# Altium schematic sheet [1]block_diagram.SchDoc
size A0; DocumentNumber: 1; SheetNumber: 1; SheetTotal: 11
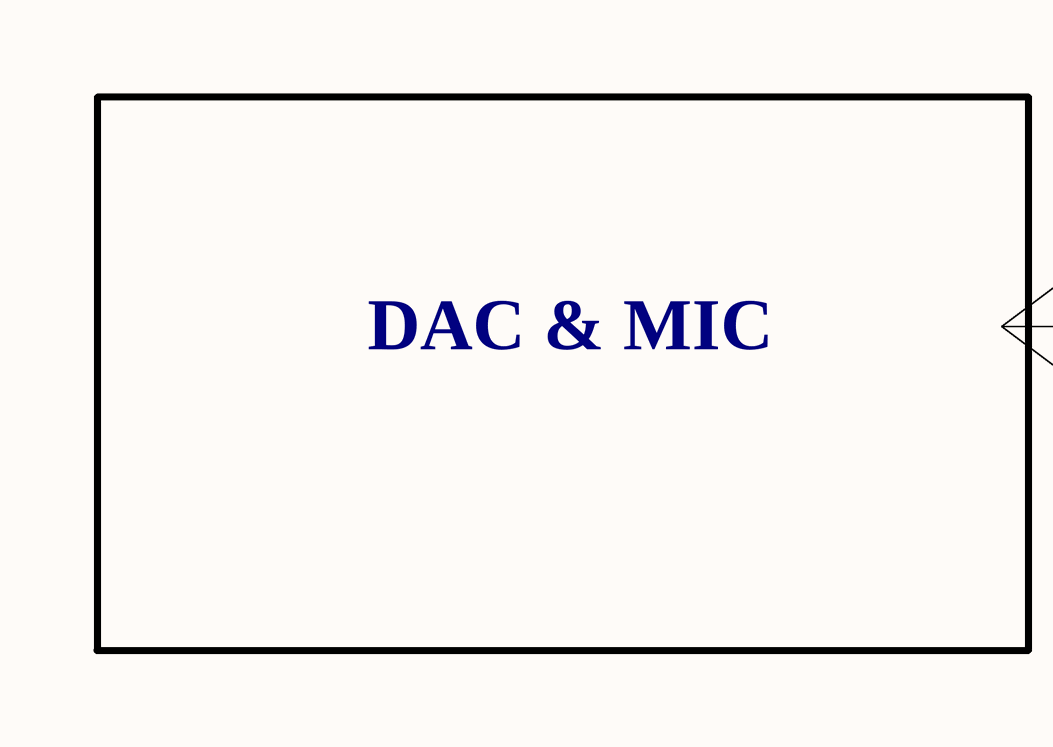
[diagram p0: [1]block_diagram.SchDoc, top left]
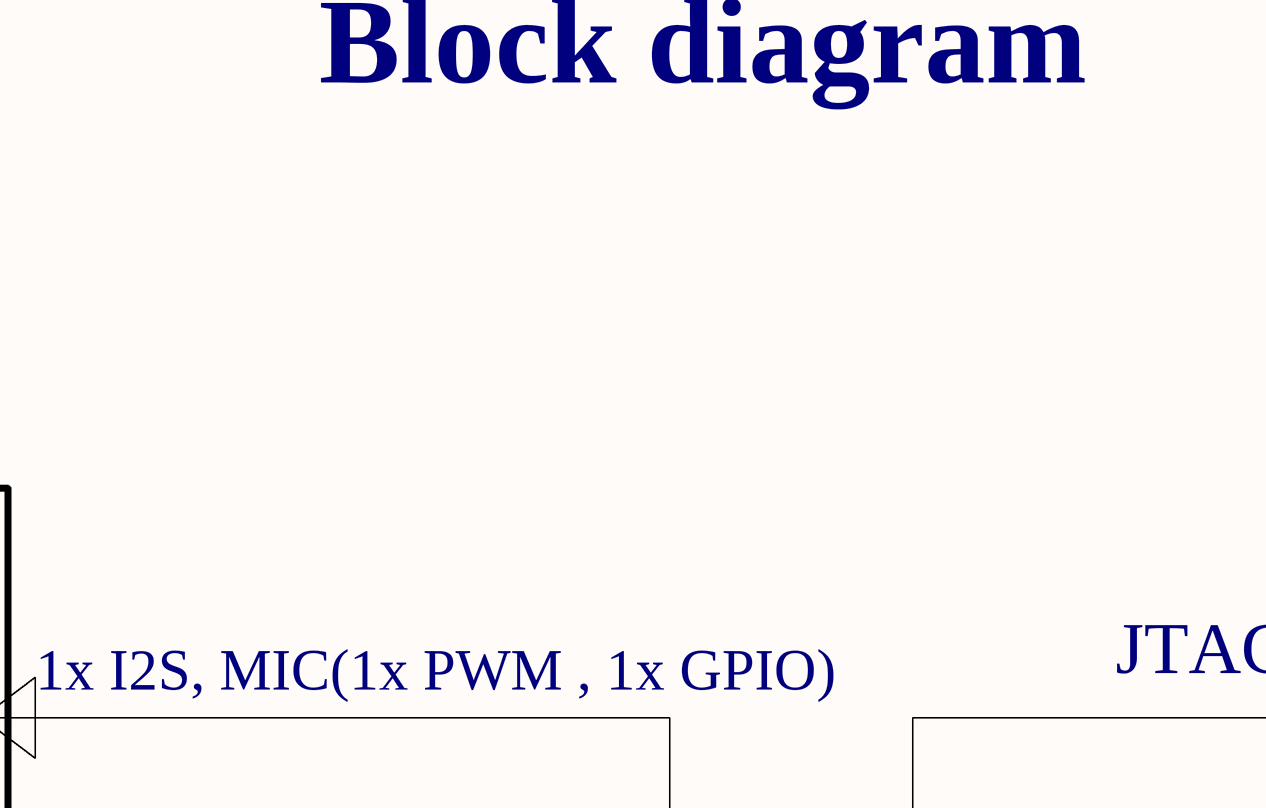
[diagram p1: [1]block_diagram.SchDoc, top middle]
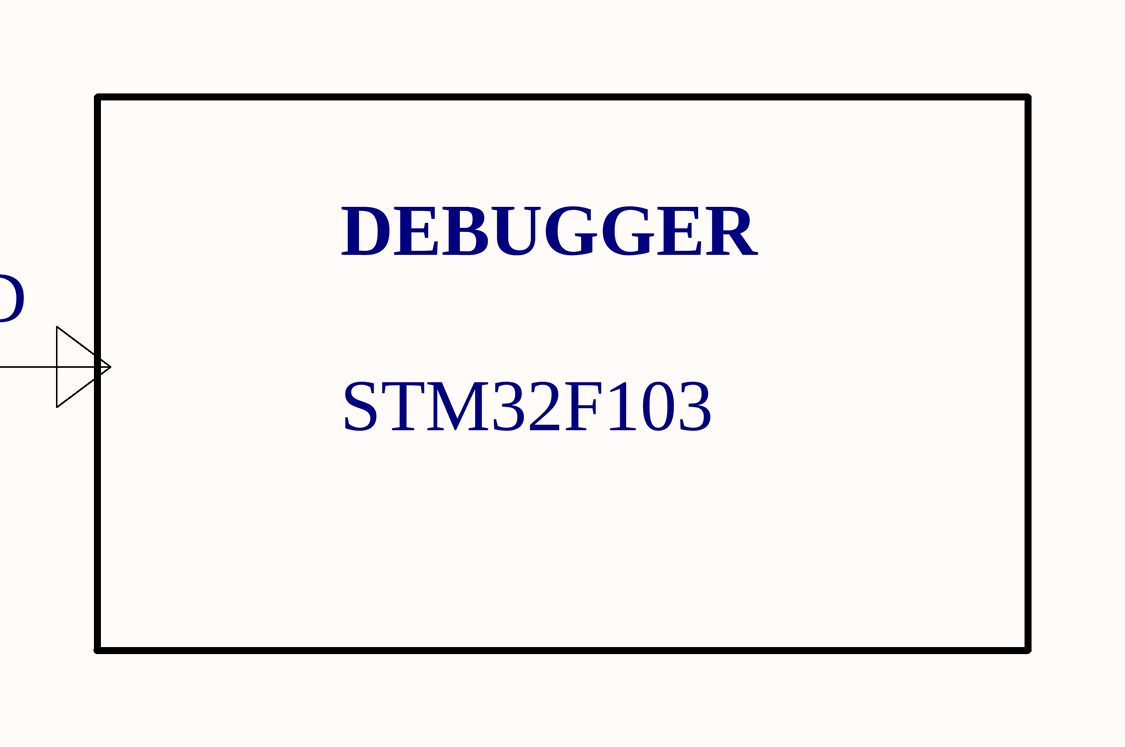
[diagram p2: [1]block_diagram.SchDoc, top right]
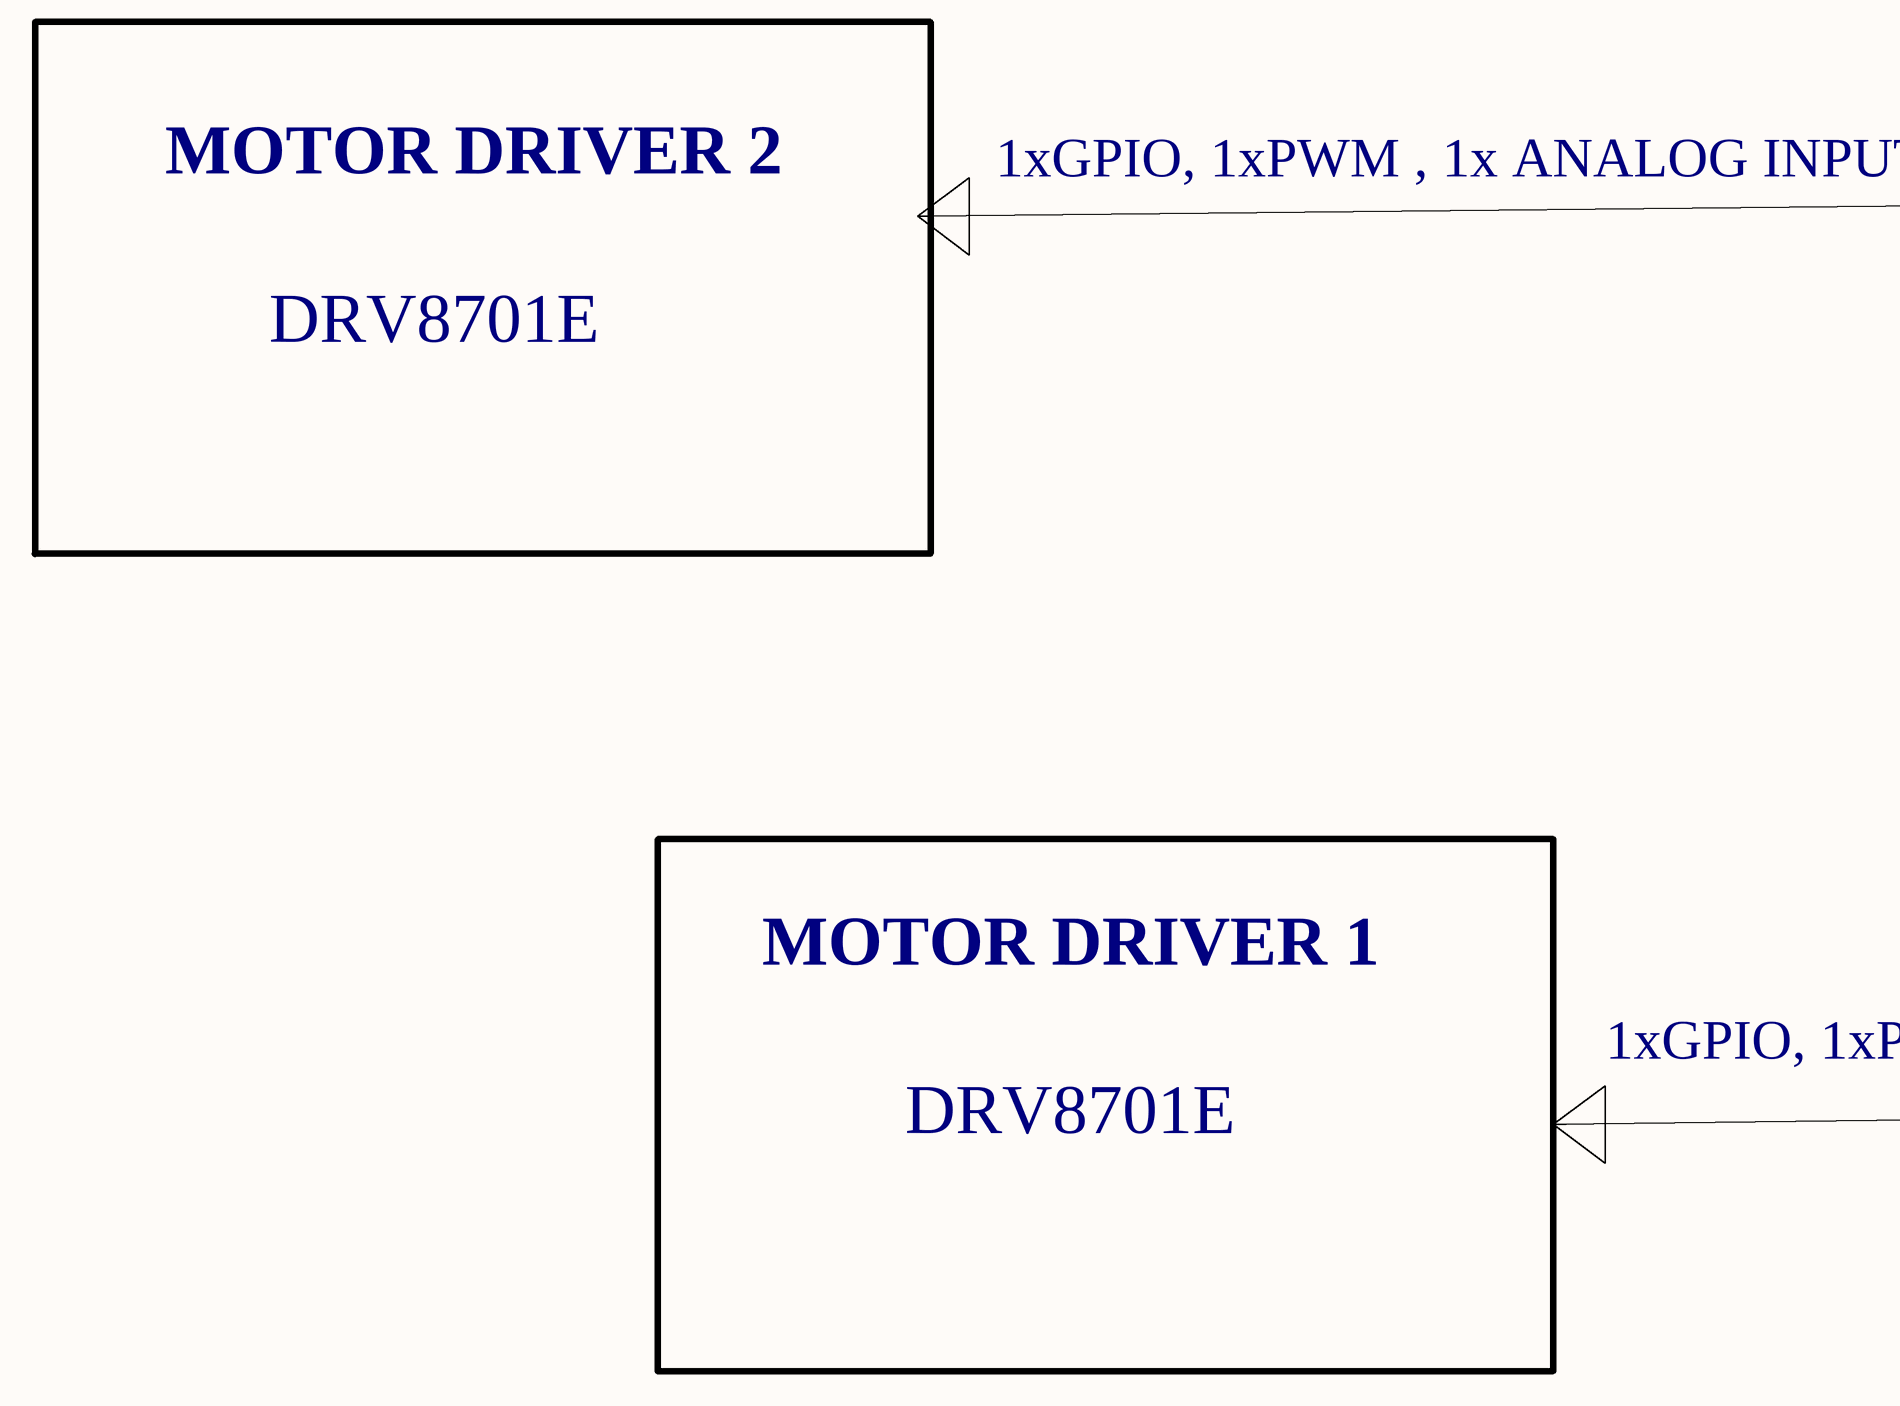
[diagram p3: [1]block_diagram.SchDoc, bottom left]
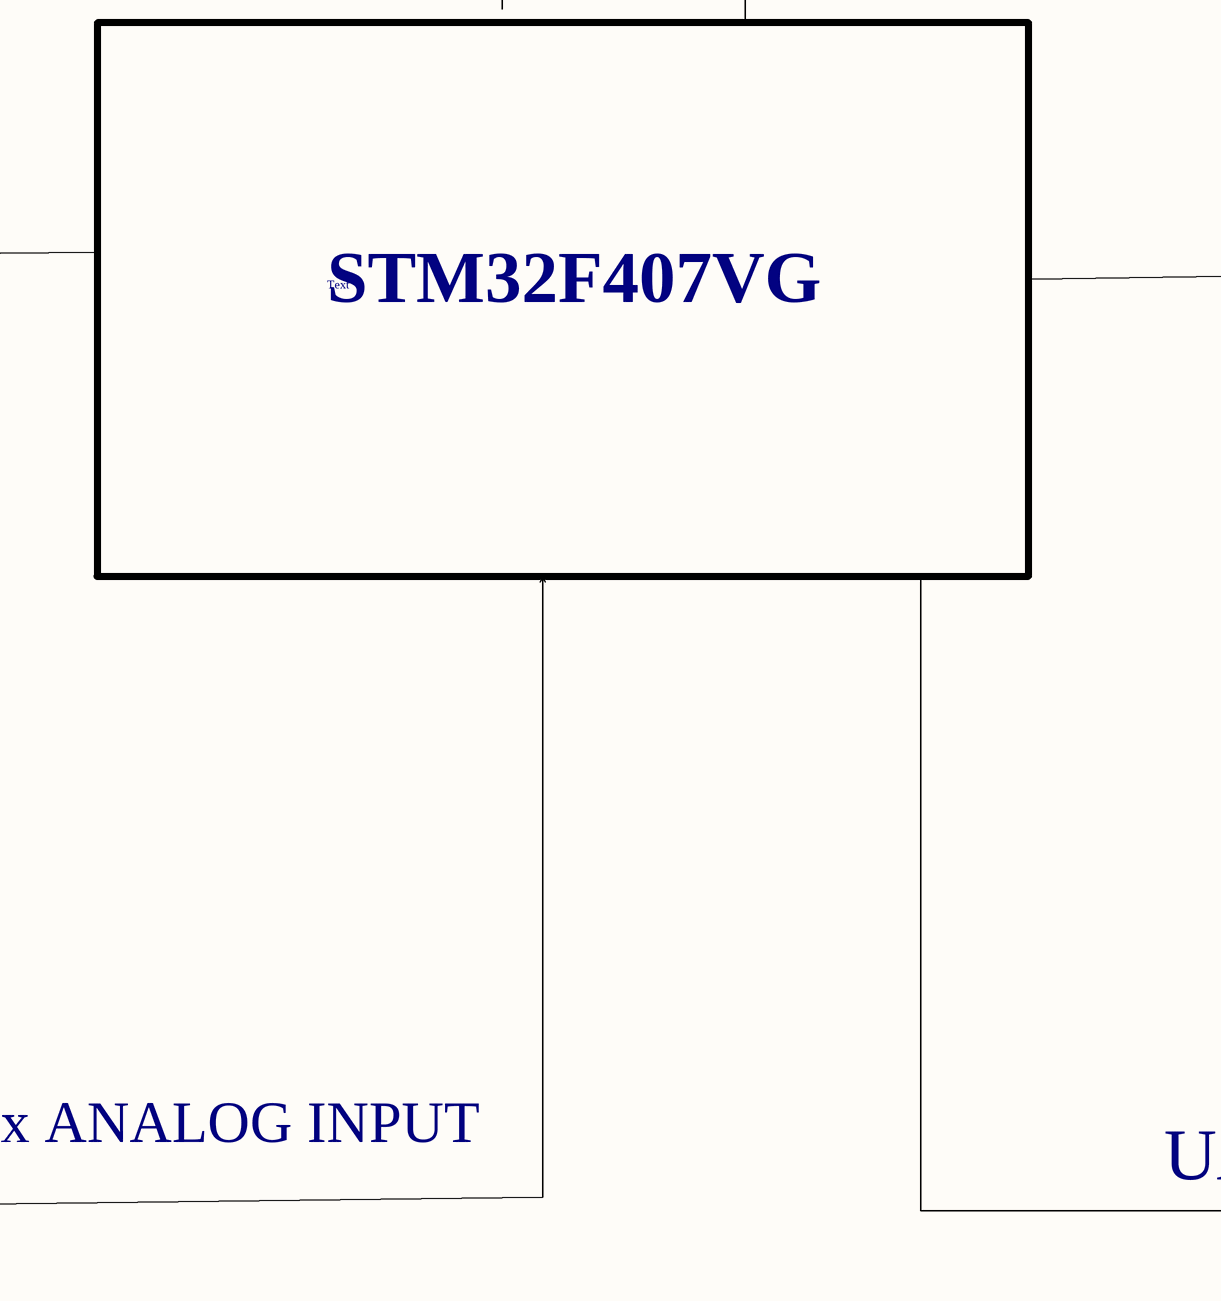
[diagram p4: [1]block_diagram.SchDoc, bottom middle]
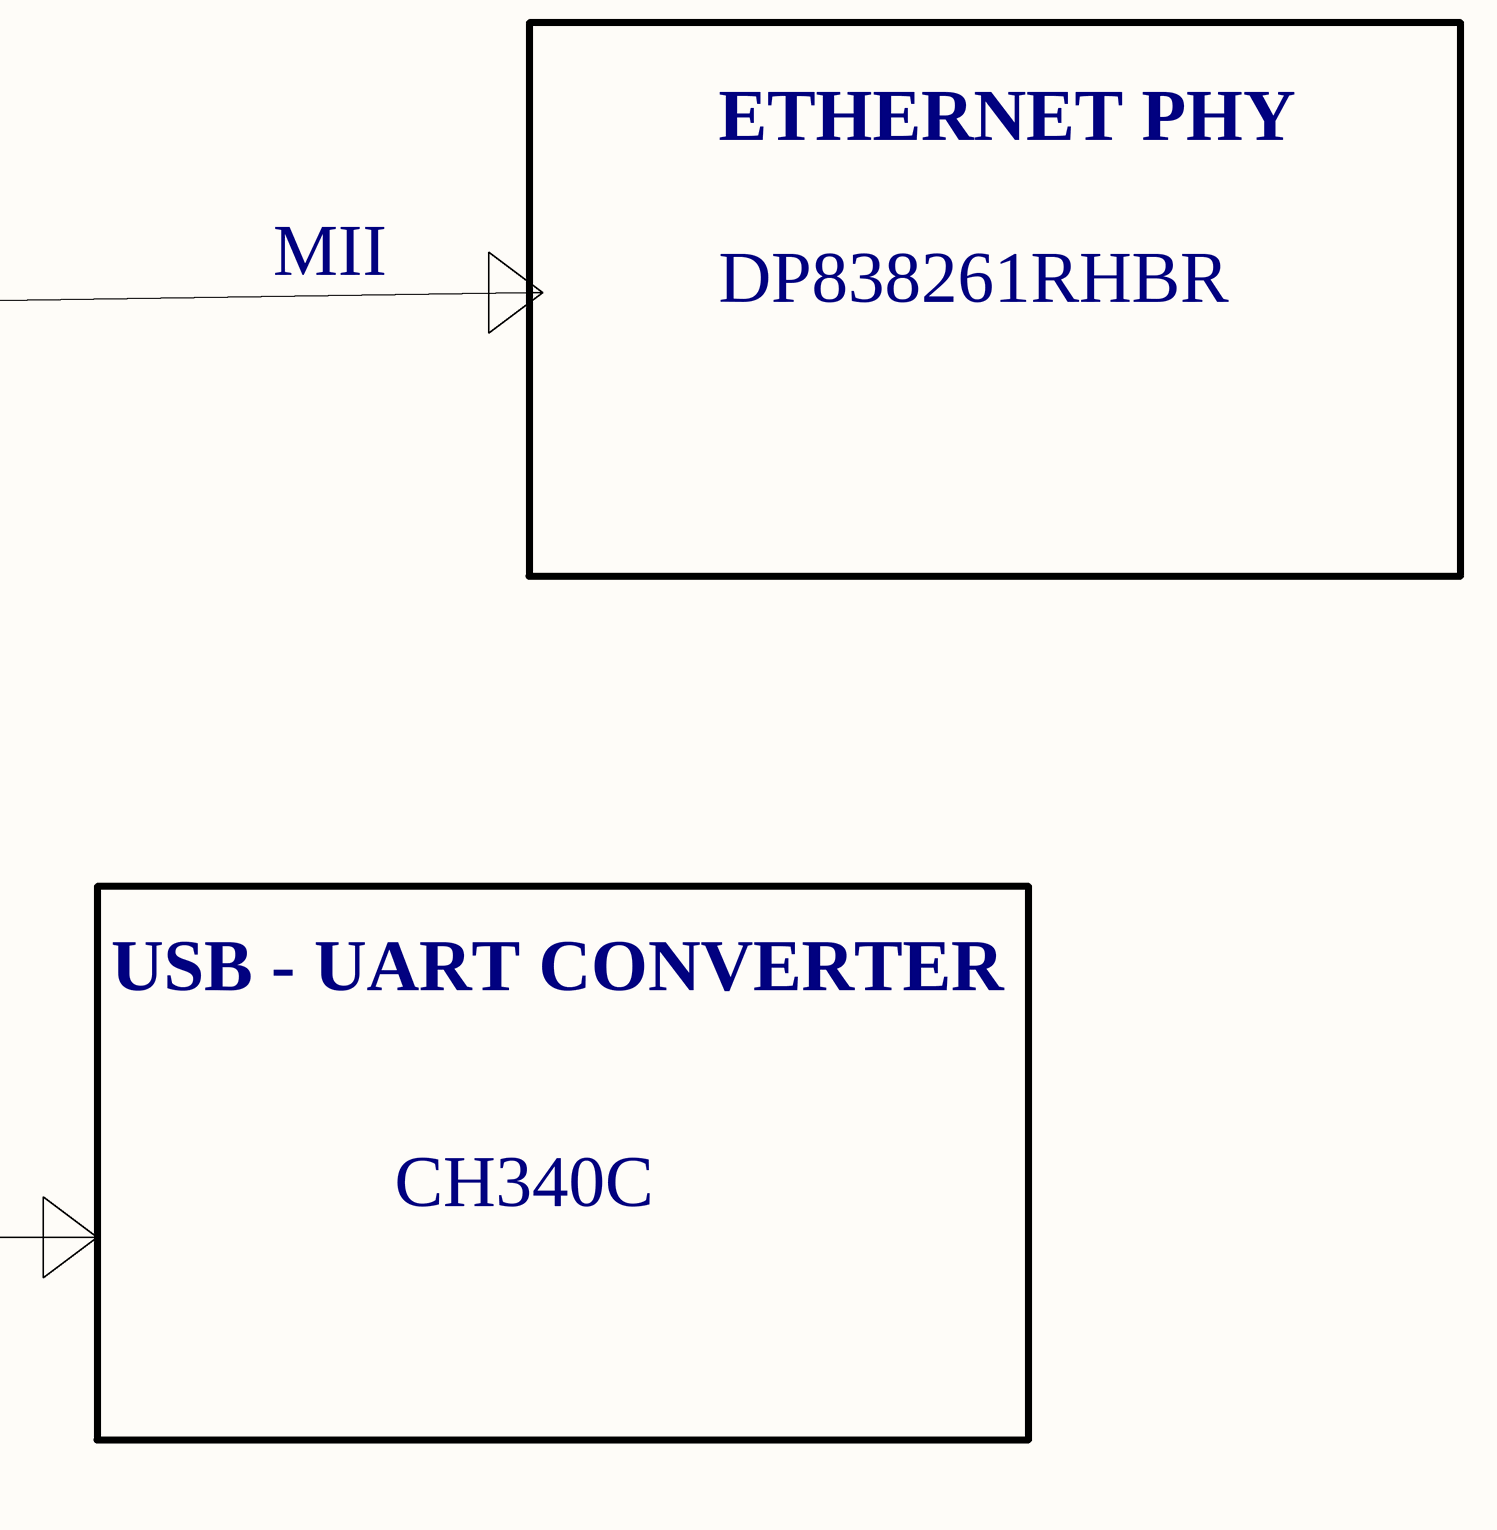
[diagram p5: [1]block_diagram.SchDoc, bottom right]

## Notes on the sheet
- Block diagram
- DEBUGGER
- 1x I2S, MIC(1x PWM , 1x GPIO)
- JTAG/SWD
- DAC & MIC
- STM32F103
- ETHERNET PHY
- MOTOR DRIVER 2
- 1xGPIO, 1xPWM , 1x ANALOG INPUT
- Text
- STM32F407VG
- MII
- DP838261RHBR
- DRV8701E
- USB - UART CONVERTER
- MOTOR DRIVER 1
- UART
- CH340C
- Title
- Size:
- Date:
- File:
- A0
- Number:
- Time:
- Revision:
- Sheet
- of